# EAGLE design 7segement4digits1badidea-mk-6.0 (EAGLE 7.5.0)
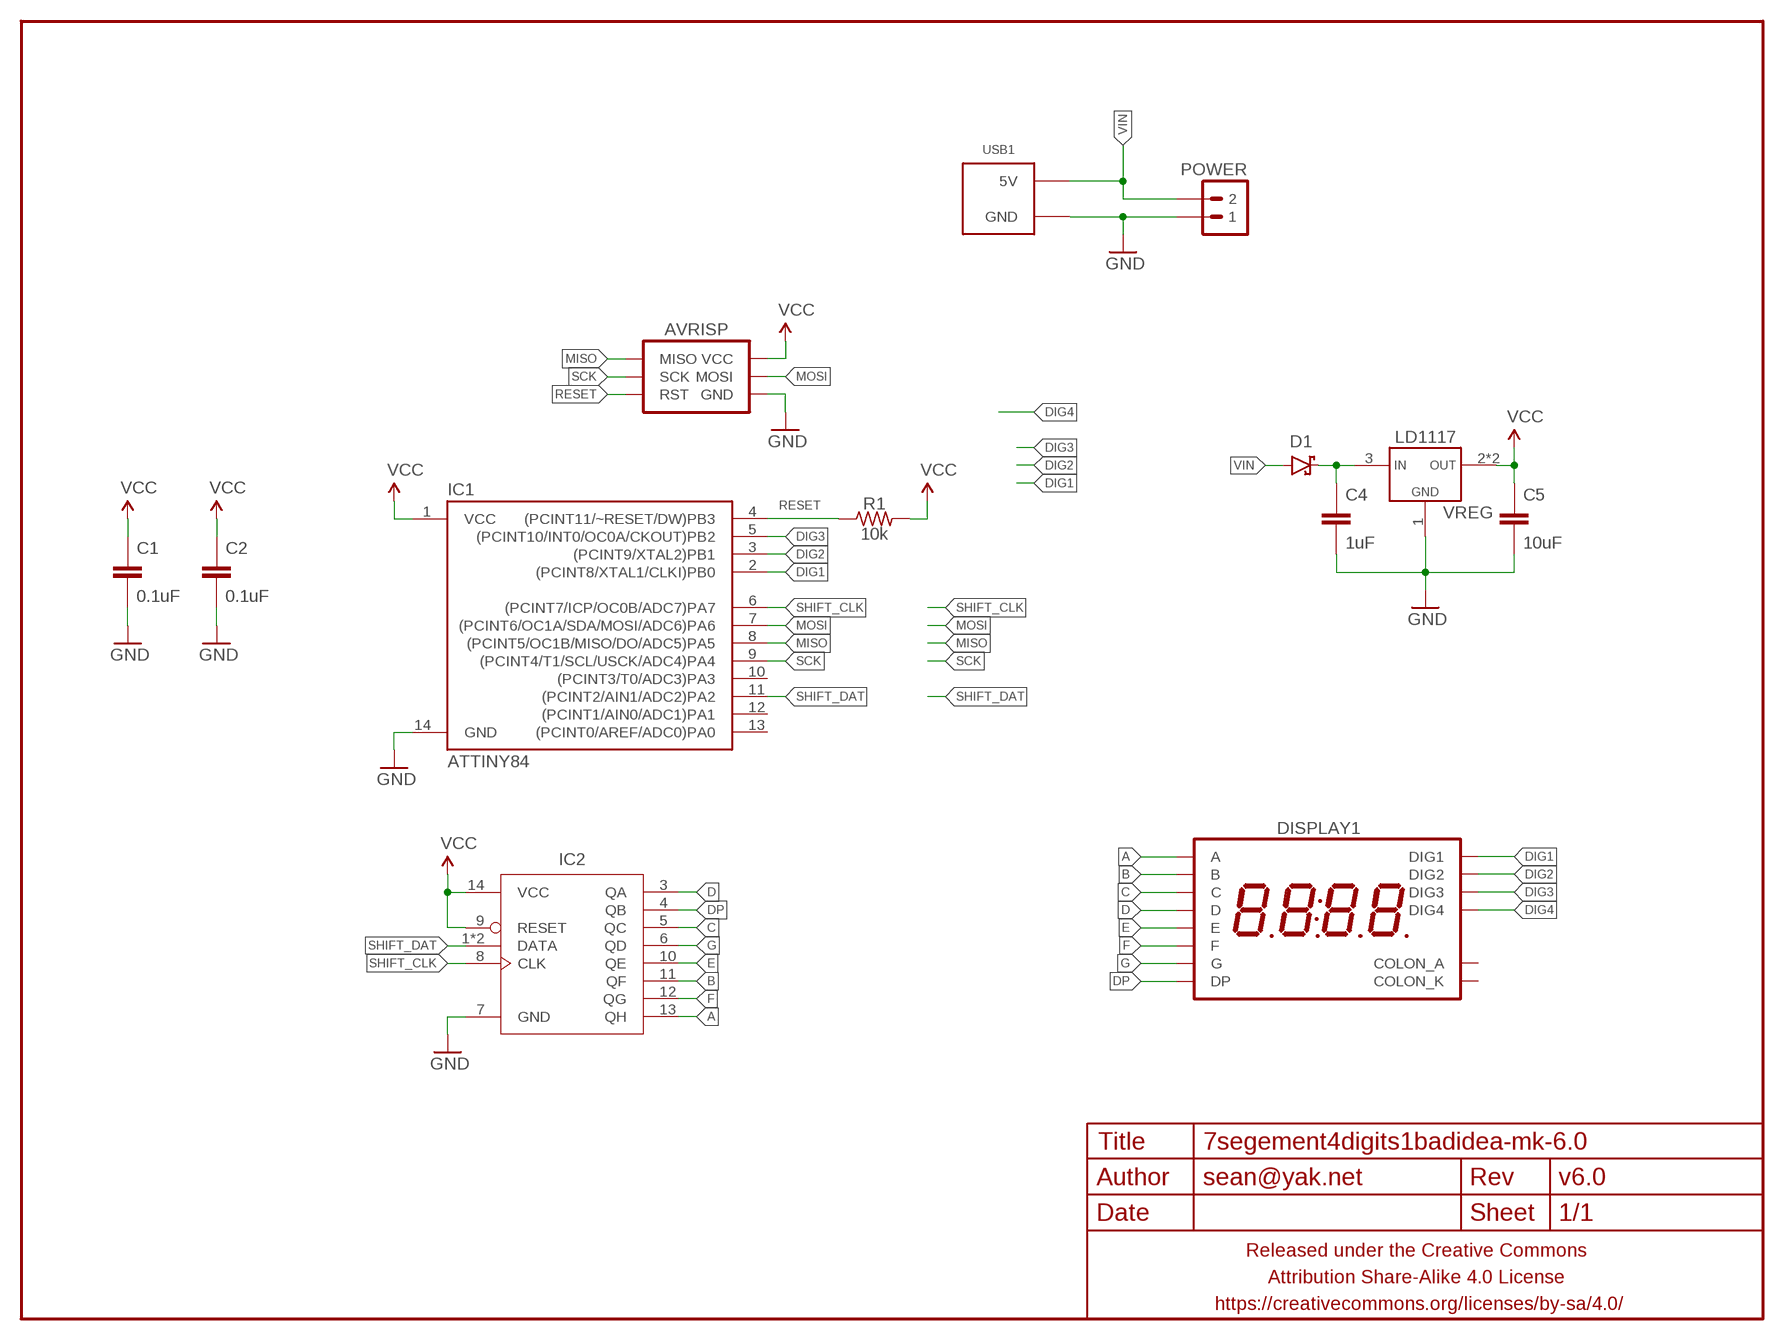
[diagram p0: schematic, sheet 1]

## Parts
AVRISP  AVR_SPI_PRG_6TESTPOINTS  [2X3_TEST_POINTS]
C1  0.1uF  CAPACITOR-CERAMICC0603  [C0603]
C2  0.1uF  CAPACITOR-CERAMICC0603  [C0603]
C4  1uF  CAPACITOR-CERAMICC0805  [C0805]
C5  10uF  CAPACITOR-CERAMICC0805  [C0805]
D1  DIODE-SCHOTTKYSOD123  [SOD123-SCHOTTKY]
DISPLAY1  7SEG_4DIGIT_COLON14.2MM-CC  [7SEG_4DIG_0.56IN_14MM_ADAFRUIT]
FRAME1  FRAME-LETTERNO_PACKAGE  [DUMMY]
IC1  ATTINY84  [SO14]
IC2  74HC164  74164SOIC  [SO14]
POWER  M02PTH-CENTERED-R+  [1X02-CENTER-R+]
R1  10k  RESISTORR0603  [R0603]
USB1  USB_AB_PWRONLY  [FCI-10103594-USB-MICRO-B-PWRONLY]
VREG  LD1117  VREG_1117SOT223  [SOT223]

## Nets
A: IC2.13(QH)
B: IC2.11(QF)
C: IC2.5(QC)
D: IC2.3(QA)
DIG1: IC1.2((PCINT8/XTAL1/CLKI)PB0)
DIG2: IC1.3((PCINT9/XTAL2)PB1)
DIG3: IC1.5((PCINT10/INT0/OC0A/CKOUT)PB2)
DIG4: DISPLAY1.P$6(DIG4)
DP: IC2.4(QB)
E: IC2.10(QE)
F: IC2.12(QG)
G: IC2.6(QD)
GND: AVRISP.6(GND) C1.2 C2.2 C4.2 C5.2 IC1.14(GND) IC2.7(GND) POWER.1 USB1.5(GND) USB1.SHIELD@1(GND) USB1.SHIELD@2(GND) USB1.SHIELD@3(GND) USB1.SHIELD@4(GND) VREG.1(GND)
MISO: AVRISP.1(MISO) IC1.8((PCINT5/OC1B/MISO/DO/ADC5)PA5)
MOSI: AVRISP.4(MOSI) IC1.7((PCINT6/OC1A/SDA/MOSI/ADC6)PA6)
N$4: C4.1 D1.C VREG.3(VIN)
RESET: AVRISP.5(RST) IC1.4((PCINT11/~RESET/DW)PB3) R1.1
SCK: AVRISP.3(SCK) IC1.9((PCINT4/T1/SCL/USCK/ADC4)PA4)
SHIFT_CLK: IC1.6((PCINT7/ICP/OC0B/ADC7)PA7) IC2.8(CLK)
SHIFT_DAT: IC1.11((PCINT2/AIN1/ADC2)PA2) IC2.1(DATA) IC2.2(DATA)
VCC: AVRISP.2(VCC) C1.1 C2.1 C5.1 IC1.1(VCC) IC2.9(RESET) IC2.14(VCC) R1.2 VREG.2(VOUT) VREG.4(VOUT)
VIN: D1.A POWER.2 USB1.1(5V)
Unconnected: DISPLAY1.P$1(E) DISPLAY1.P$2(D) DISPLAY1.P$3(DP) DISPLAY1.P$4(C) DISPLAY1.P$5(G) DISPLAY1.P$7(COLON_K) DISPLAY1.P$8(COLON_A) DISPLAY1.P$9(B) DISPLAY1.P$10(DIG3) DISPLAY1.P$11(DIG2) DISPLAY1.P$12(F) DISPLAY1.P$13(A) DISPLAY1.P$14(DIG1) IC1.10((PCINT3/T0/ADC3)PA3) IC1.12((PCINT1/AIN0/ADC1)PA1) IC1.13((PCINT0/AREF/ADC0)PA0)

## Library data of the parts
AVRISP = A_butts:AVR_SPI_PRG_6: AVR ISP 6 Pin This is the reduced ISP connector for AVR programming. Common on Arduino. This footprint will take up less PCB space and can be used with a 10-pin to 6-pin adapter such as SKU: BOB-08508 **Special note about "TEST_POINT" package. The stop mask is on the top side, so if you want your programming test points to be on the bottom of your board, make sure to place this package on the bottom side of the board. This also ensure that the orientation to program from the bottom side will be correct.
C1 C2 C4 C5 = A_butts:CAPACITOR-CERAMIC: CAPACITOR, European symbol
D1 = a_parts:DIODE-SCHOTTKY: Schottky diodes in SFE's production catalog BAT20J 1A 23V 0.62Vf RB751 120mA 40V 0.37Vf PMEG4005EJ 0.5A 40V 0.42Vf MBRA140 1A 40V 0.5Vf B340A 3A 40V SMA
DISPLAY1 = a_parts:7SEG_4DIGIT_COLON
FRAME1 = A_butts:FRAME-LETTER: Schematic Frame Standard 8.5x11 US Letter frame; DESIGNER: sean@yak.net; VERSION: v6.0
IC1 = A_butts:ATTINY84: Atmel 14-pin 2/4/8kB flash uC
IC2 = a_parts:74*164
POWER = A_butts:M02: Standard 2-pin 0.1" header. Use with - straight break away headers ( PRT-00116) - right angle break away headers (PRT-00553) - swiss pins (PRT-00743) - machine pins (PRT-00117) - female headers (PRT-00115) Molex polarized connector foot print use with: PRT-08233 with associated crimp pins and housings. 2.54_SCREWTERM for use with PRT-10571. 3.5mm Screw Terminal footprints for PRT-08084 5mm Screw Terminal footprints for use with PRT-08433
R1 = A_butts:RESISTOR: RESISTOR, American symbol
USB1 = A_butts:USB_AB_PWRONLY
VREG = a_parts:VREG_1117

## Board
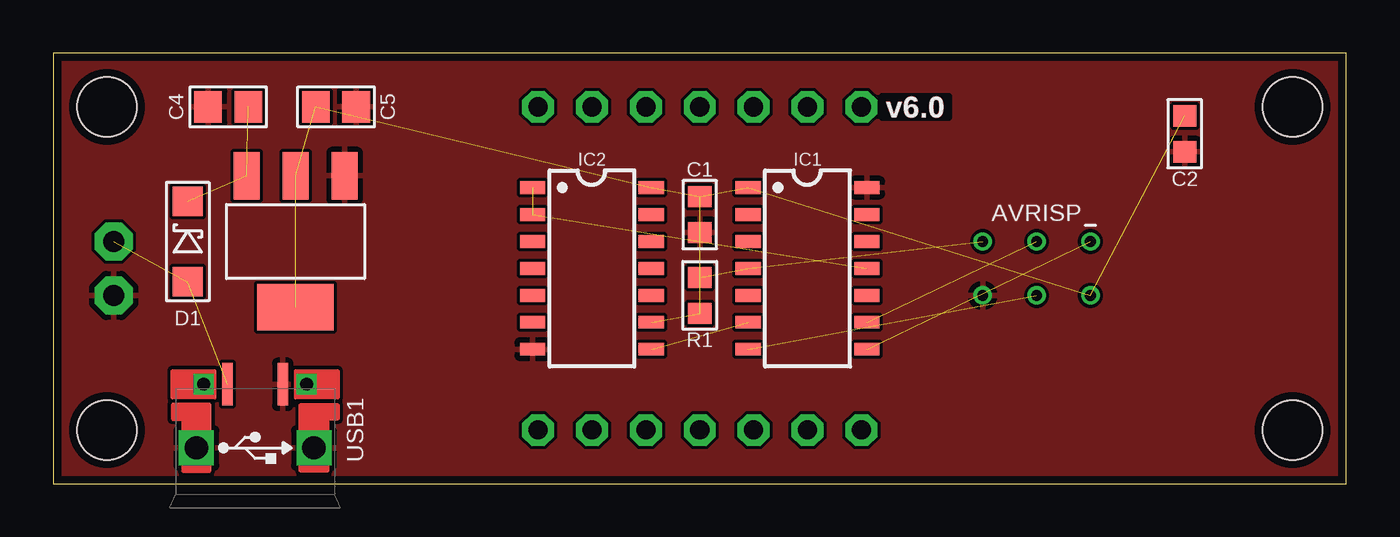
[diagram p1: board, top side]
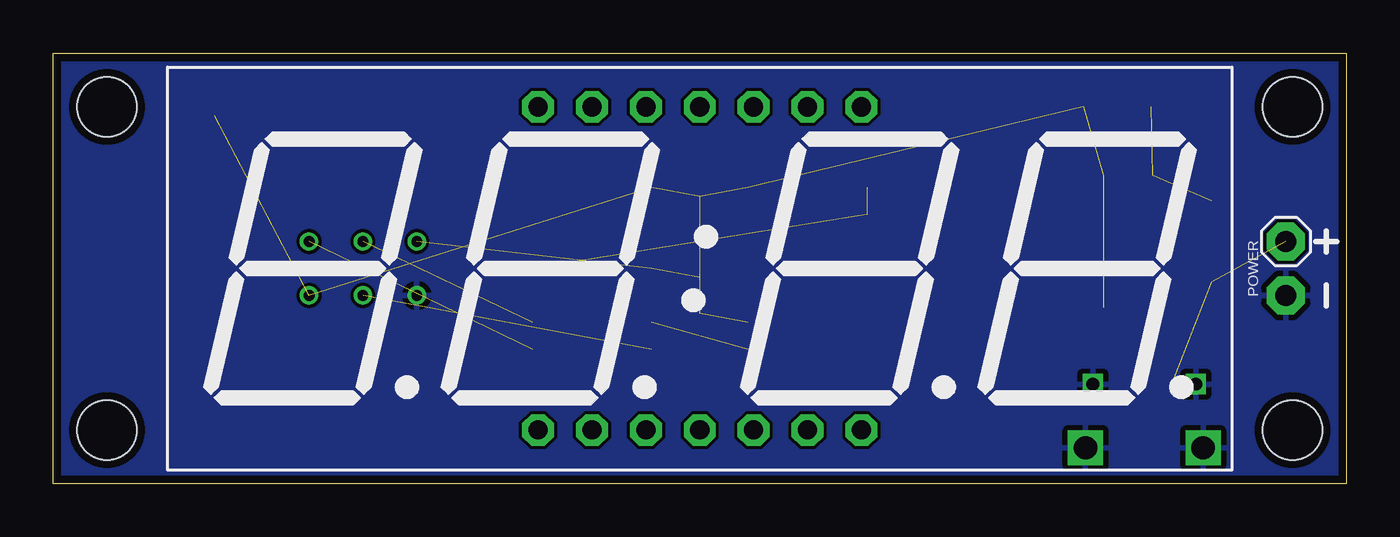
[diagram p2: board, bottom side, seen from below]

Size 60.96 x 20.32 mm. Coordinates in mm from the lower left corner, seen from the top.
Outline: 60.96,0 60.96,20.32 0,20.32 0,0 60.96,0
Copper layers (1*16): Top 0.0356mm / dielectric 1.5011mm / Bottom 0.0356mm
Design rules "LaenPCBOrder_2": minimum track width 6mil, minimum drill 13mil, track to track 6mil, track to pad 6mil, pad to pad 6mil, via to via 6mil, smd to smd 6mil, copper to edge 15mil, drill to drill 6mil, minimum pad ring 7mil, minimum via ring 7mil, stop-mask expansion 3mil, vias tented up to drill 20mil, thermal gap 10mil
Holes 2.8 mm at 2.54,2.54 58.42,17.78 2.54,17.78 58.42,2.54

### Footprints (pad centres in the part's own frame; a part is rotated, then mirrored left to right if it is on the bottom)
2X3_TEST_POINTS = drill 0.508: 1 -2.54,-1.27; 2 -2.54,1.27; 3 0,-1.27; 4 0,1.27; 5 2.54,-1.27; 6 2.54,1.27
C0603 = smd 1 x 1.1: 1 -0.85,0; 2 0.85,0
C0805 = smd 1.3 x 1.5: 1 -0.95,0; 2 0.95,0
SOD123-SCHOTTKY = smd 1.4 x 1.4: A -1.9,0; C 1.9,0
7SEG_4DIG_0.56IN_14MM_ADAFRUIT = drill 0.9 pad 1.5 octagon: P$1 -7.62,7.62; P$2 -5.08,7.62; P$3 -2.54,7.62; P$4 0,7.62; P$5 2.54,7.62; P$6 5.08,7.62; P$7 7.62,7.62; P$8 7.62,-7.62; P$9 5.08,-7.62; P$10 2.54,-7.62; P$11 0,-7.62; P$12 -2.54,-7.62; P$13 -5.08,-7.62; P$14 -7.62,-7.62
SO14 = smd 0.6 x 1.2: 1 -3.81,-2.8; 2 -2.54,-2.8; 3 -1.27,-2.8; 4 0,-2.8; 5 1.27,-2.8; 6 2.54,-2.8; 7 3.81,-2.8; 8 3.81,2.8; 9 2.54,2.8; 10 1.27,2.8; 11 0,2.8; 12 -1.27,2.8; 13 -2.54,2.8; 14 -3.81,2.8
1X02-CENTER-R+ = drill 1 pad 1.8 octagon: 1 -1.27,0; 2 1.27,0
R0603 = smd 1 x 1.1: 1 -0.85,0; 2 0.85,0
FCI-10103594-USB-MICRO-B-PWRONLY = smd 0.5 x 2: 1 -1.3,3; 5 1.3,3 | drill 0.6 square: SHIELD@1 -2.425,3; SHIELD@2 2.425,3 | drill 1.1 pad 1.3 square: SHIELD@3 -2.775,0; SHIELD@4 2.775,0
SOT223 = smd 1.219 x 2.235: 1 -2.311,-3.099; 2 0,-3.099; 3 2.311,-3.099 | smd 3.6 x 2.2: 4 0,3.099

### Placement (x,y rotation side)
AVRISP  46.35,10.16 180 top
C1  30.48,12.7 270 top
C2  53.34,16.51 270 top
C4  8.26,17.78 180 top
C5  13.34,17.78 0 top
D1  6.35,11.43 90 top
DISPLAY1  30.48,10.16 0 bottom
FRAME1  0,-0.5 0 top
IC1  35.56,10.16 270 top
IC2  25.4,10.16 270 top
POWER  2.86,10.16 90 bottom
R1  30.48,8.89 270 top
USB1  9.53,1.7 0 top
VREG  11.43,11.43 180 top

### Tracks (layer width: path | path; a pad name or v marks a point on that pad's centre or on a via)
GND
  pour Top: 0,0 0,20.32 60.96,20.32 60.96,0
  pour Bottom: 60.96,0 0,0 0,20.32 60.96,20.32
MISO  (1 unrouted)
MOSI  (1 unrouted)
N$4  (2 unrouted)
RESET  (2 unrouted)
SCK  (1 unrouted)
SHIFT_CLK  (1 unrouted)
SHIFT_DAT  (2 unrouted)
VCC  (9 unrouted)
VIN  (2 unrouted)